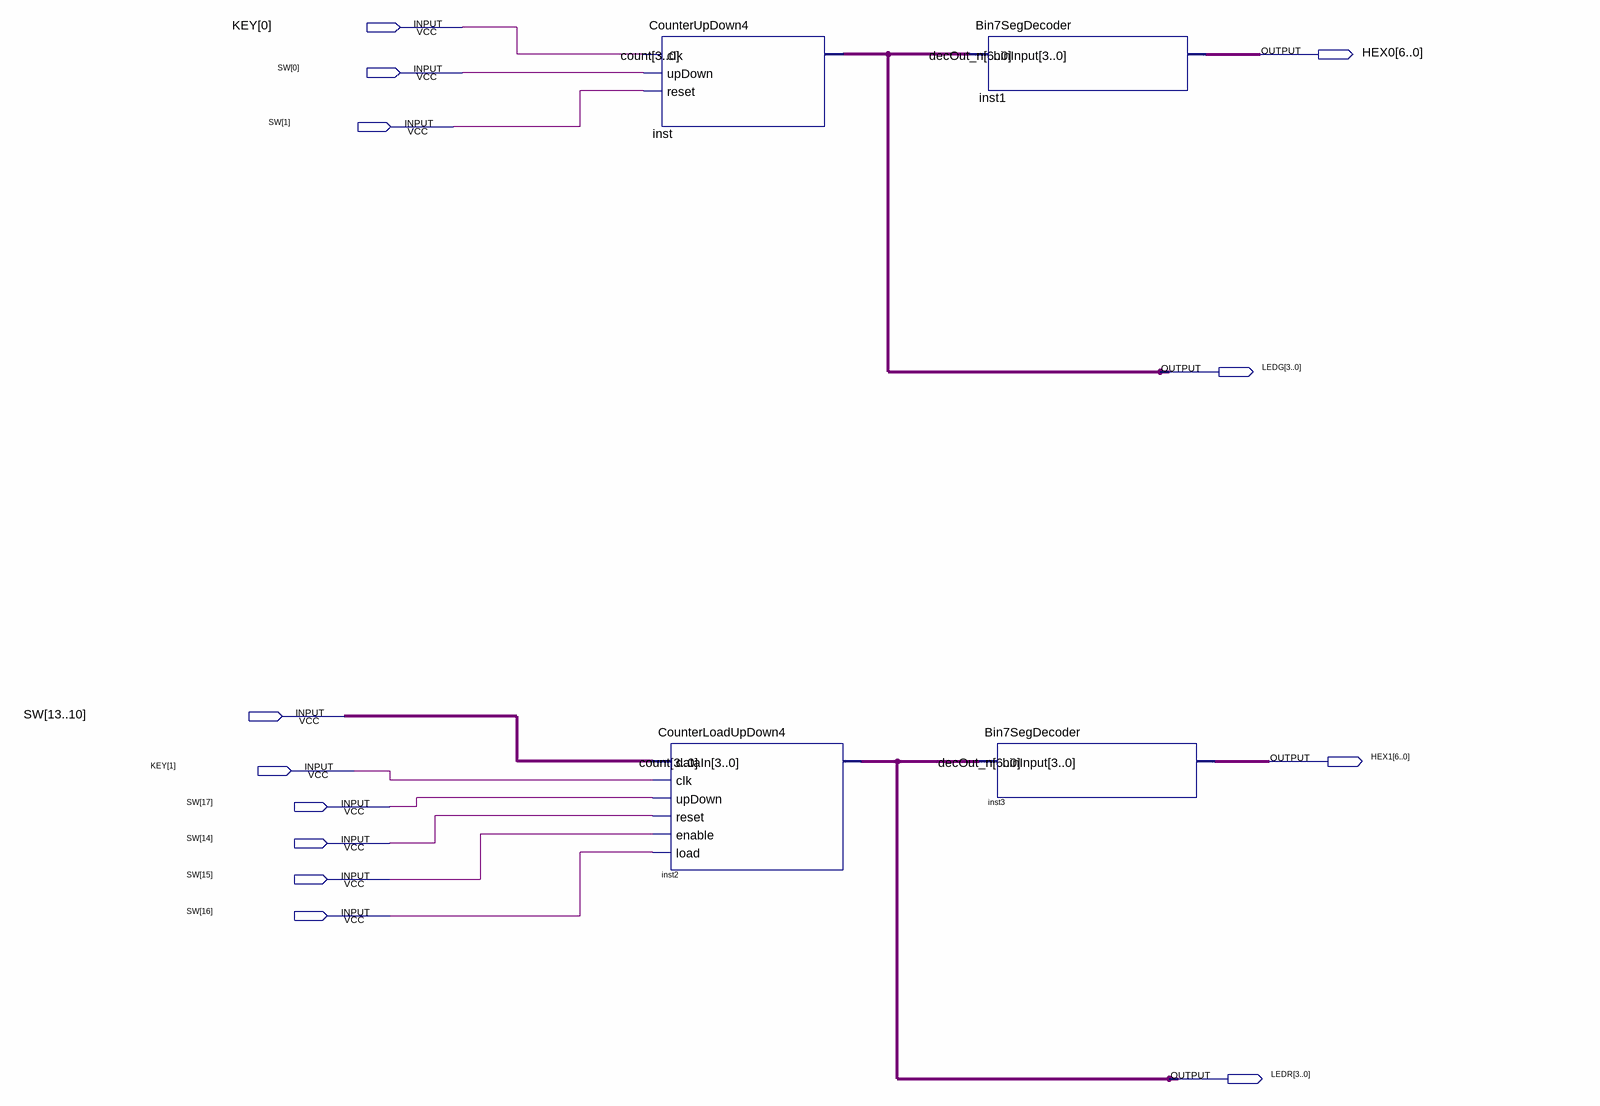
[diagram p0: schematic sheet]
// Quartus schematic Counter_Demo.bdf as structural Verilog: 4 symbols, 13 pins
module Counter_Demo (
  input  [1:0] KEY,
  input  [17:0] SW,
  output [6:0] HEX0,
  output [3:0] LEDG,
  output [6:0] HEX1,
  output [3:0] LEDR
);

  CounterUpDown4 inst (.clk(KEY[0]), .upDown(SW[0]), .reset(SW[1]), .count(LEDG));
  CounterLoadUpDown4 inst2 (
    .dataIn(SW[13:10]), .clk(KEY[1]), .upDown(SW[17]), .reset(SW[14]), .enable(SW[15]), .load(SW[16]),
    .count(LEDR));
  Bin7SegDecoder inst1 (.binInput(LEDG), .decOut_n(HEX0));
  Bin7SegDecoder inst3 (.binInput(LEDR), .decOut_n(HEX1));
endmodule
